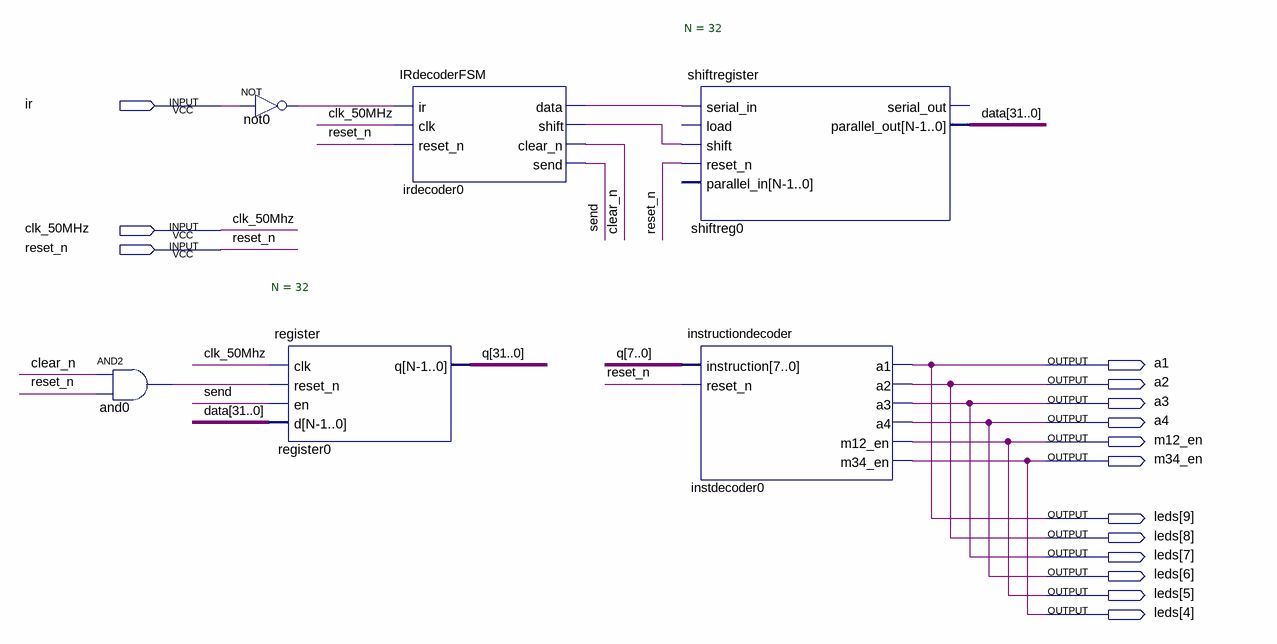
[diagram p0: schematic sheet]
// Quartus schematic finalproject.bdf as structural Verilog: 6 symbols, 15 pins
module finalproject (
  input  ir,
  input  clk_50MHz,
  input  reset_n,
  output a1,
  output a2,
  output a3,
  output a4,
  output m12_en,
  output m34_en,
  output [9:4] leds
);

  wire and0_out, clear_n, irdecoder0_data, irdecoder0_shift, not0_out, send;
  wire [31:0] data, q;

  and and0 (and0_out, clear_n, reset_n);
  not not0 (not0_out, ir);
  register #(.N(32)) register0 (.clk(clk_50MHz), .reset_n(and0_out), .en(send), .d(data), .q(q));
  IRdecoderFSM irdecoder0 (
    .ir(not0_out), .clk(clk_50MHz), .reset_n(reset_n), .data(irdecoder0_data), .shift(irdecoder0_shift),
    .clear_n(clear_n), .send(send));
  shiftregister #(.N(32)) shiftreg0 (
    .serial_in(irdecoder0_data), .shift(irdecoder0_shift), .reset_n(reset_n), .parallel_out(data));  // open: load, parallel_in, serial_out
  instructiondecoder instdecoder0 (
    .instruction(q[7:0]), .reset_n(reset_n), .a1(a1), .a2(a2), .a3(a3), .a4(a4), .m12_en(leds[5]),
    .m34_en(leds[4]));

  assign leds[9:6] = {a1, a2, a3, a4};
  assign m12_en = leds[5];
  assign m34_en = leds[4];
endmodule
